# EAGLE design sunjar-v1.1 (EAGLE 6.4)
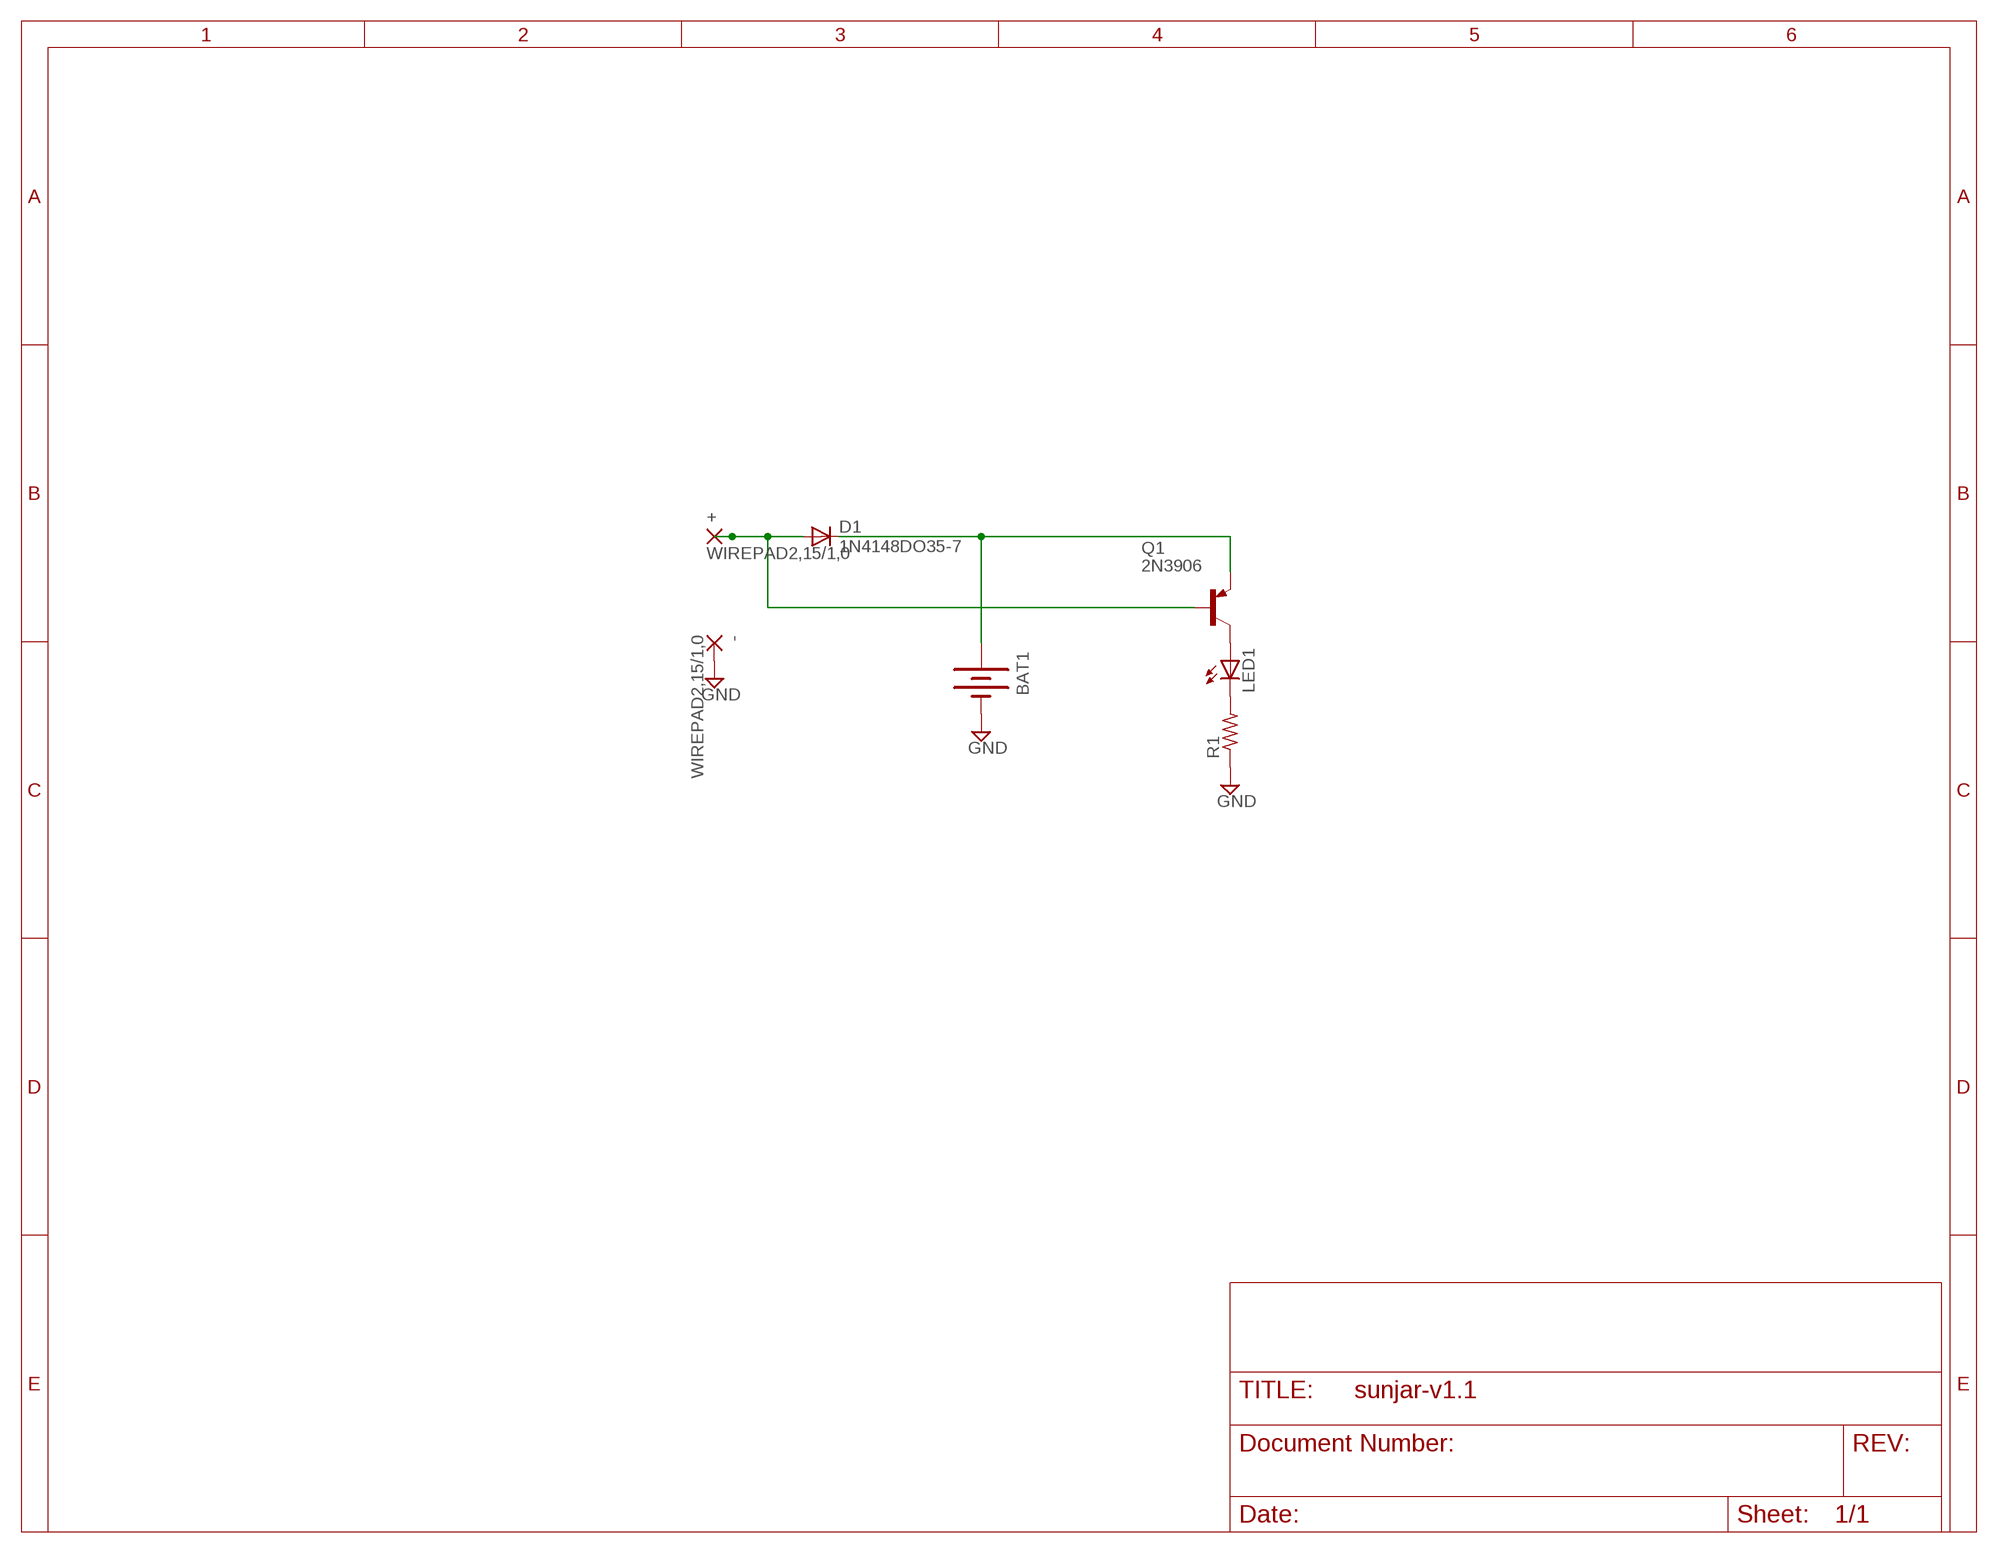
[diagram p0: schematic, sheet 1]

## Parts
+  WIREPAD2,15/1,0  [2,15/1,0]
-  WIREPAD2,15/1,0  [2,15/1,0]
BAT1  BATTERY245PTH  [BATTCON_245MM_PTH]
D1  1N4148DO35-7  [DO35-7]
LED1  LED5MM  [LED5MM]
Q1  2N3906  [TO92]
R1  R-US_0207/10  [0207/10]

## Nets
GND: -.1(P) BAT1.2(-) R1.1
N$1: LED1.K(C) R1.2
N$2: LED1.A Q1.1(C)
N$3: +.1(P) D1.A Q1.2(B)
N$4: BAT1.3(+) D1.C Q1.3(E)

## Library data of the parts
+ - = wirepad:WIREPAD: Wire PAD connect wire on PCB
BAT1 = SparkFun-Electromechanical:BATTERY: Battery Holders Various common sizes : AA, AAA, 20mm coin cell and 12mm coin cell. 20MM_4LEGS, BATT-10373
D1 = diode:1N4148: DIODE high speed (Philips)
LED1 = led:LED: LED OSRAM: - CHIPLED LG R971, LG N971, LY N971, LG Q971, LY Q971, LO R971, LY R971 LH N974, LH R974 LS Q976, LO Q976, LY Q976 LO Q996 - Hyper CHIPLED LW Q18S LB Q993, LB Q99A, LB R99A - SideLED LS A670, LO A670, LY A670, LG A670, LP A670 LB A673, LV A673, LT A673, LW A673 LH A674 LY A675 LS A676, LA A676, LO A676, LY A676, LW A676 LS A679, LY A679, LG A679 - Hyper Micro SIDELED® LS Y876, LA Y876, LO Y876, LY Y876 LT Y87S - SmartLED LW L88C, LW L88S LB L89C, LB L89S, LG L890 LS L89K, LO L89K, LY L89K LS L896, LA L896, LO L896, LY L896 - TOPLED LS T670, LO T670, LY T670, LG T670, LP T670 LSG T670, LSP T670, LSY T670, LOP T670, LYG T670 LG T671, LOG T671, LSG T671 LB T673, LV T673, LT T673, LW T673 LH T674 LS T676, LA T676, LO T676, LY T676, LB T676, LH T676, LSB T676, LW T676 LB T67C, LV T67C, LT T67C, LS T67K, LO T67K, LY T67K, LW E67C LS E67B, LA E67B, LO E67B, LY E67B, LB E67C, LV E67C, LT E67C LW T67C LS T679, LY T679, LG T679 LS T770, LO T770, LY T770, LG T770, LP T770 LB T773, LV T773, LT T773, LW T773 LH T774 LS E675, LA E675, LY E675, LS T675 LS T776, LA T776, LO T776, LY T776, LB T776 LHGB T686 LT T68C, LB T68C - Hyper Mini TOPLED® LB M676 - Mini TOPLED Santana® LG M470 LS M47K, LO M47K, LY M47K Source: http://www.osram.convergy.de LUXEON: - LUMILED® LXK2-PW12-R00, LXK2-PW12-S00, LXK2-PW14-U00, LXK2-PW14-V00 LXK2-PM12-R00, LXK2-PM12-S00, LXK2-PM14-U00 LXK2-PE12-Q00, LXK2-PE12-R00, LXK2-PE12-S00, LXK2-PE14-T00, LXK2-PE14-U00 LXK2-PB12-K00, LXK2-PB12-L00, LXK2-PB12-M00, LXK2-PB14-N00, LXK2-PB14-P00, LXK2-PB14-Q00 LXK2-PR12-L00, LXK2-PR12-M00, LXK2-PR14-Q00, LXK2-PR14-R00 LXK2-PD12-Q00, LXK2-PD12-R00, LXK2-PD12-S00 LXK2-PH12-R00, LXK2-PH12-S00 LXK2-PL12-P00, LXK2-PL12-Q00, LXK2-PL12-R00 Source: www.luxeon.com KINGBRIGHT: KA-3528ASYC Source: www.kingbright.com
Q1 = transistor-pnp:2N3906: PNP Transistor
R1 = rcl:R-US_: RESISTOR, American symbol

## Board
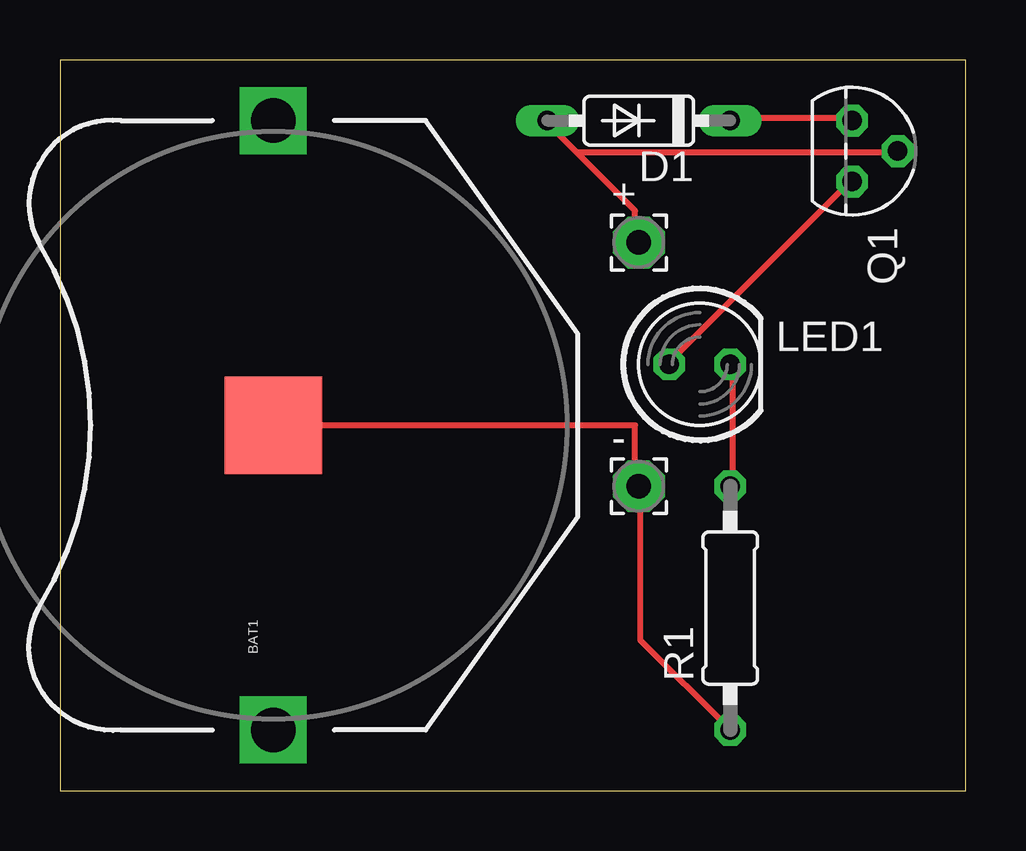
[diagram p1: board, top side]
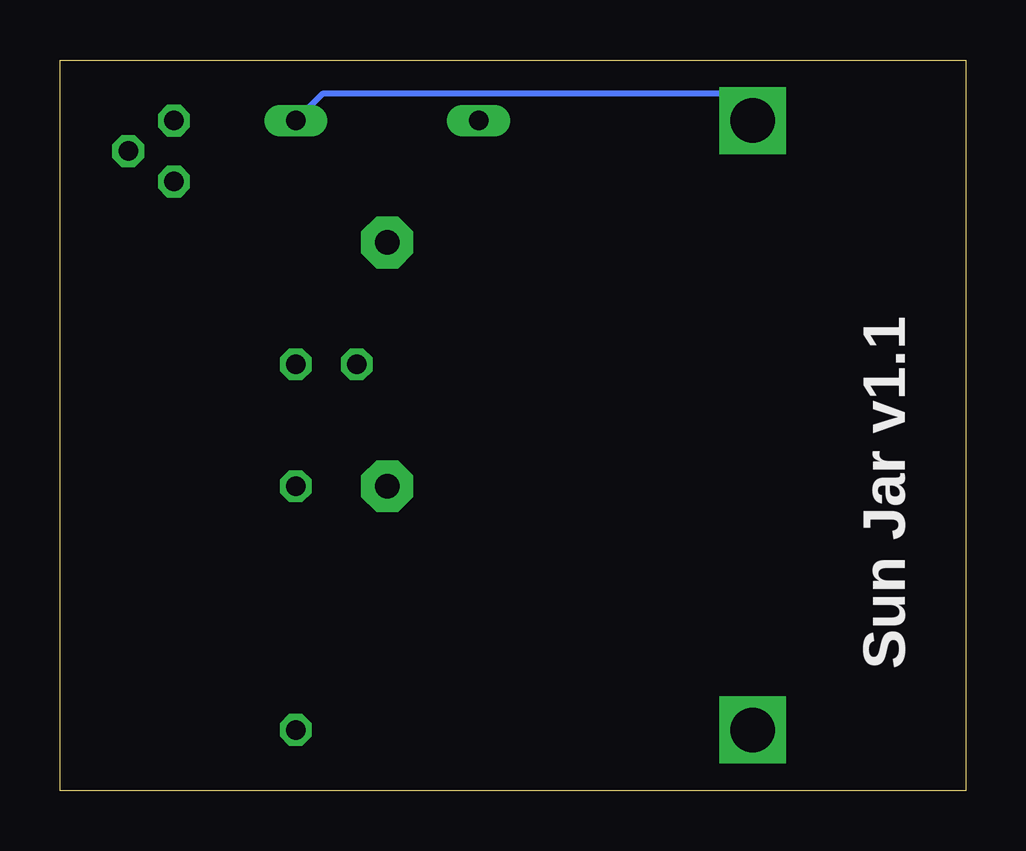
[diagram p2: board, bottom side, seen from below]

Size 37.77 x 30.47 mm. Coordinates in mm from the lower left corner, seen from the top.
Outline: 0,0 37.77,0 37.77,30.47 0,30.47 0,0
Copper layers (1*16): Top 0.035mm / dielectric 1.5mm / Bottom 0.035mm
Design rules "default": minimum track width 10mil, minimum drill 24mil, track to track 8mil, track to pad 8mil, pad to pad 8mil, via to via 8mil, smd to smd 8mil, copper to edge 40mil, drill to drill 8mil, minimum pad ring 10mil, minimum via ring 8mil, stop-mask expansion 4mil, vias tented up to drill 0mil, thermal gap 10mil

### Footprints (pad centres in the part's own frame; a part is rotated, then mirrored left to right if it is on the bottom)
2,15/1,0 = drill 1.016 pad 2.159 octagon: 1 0,0
BATTCON_245MM_PTH = drill 1.854 square: 1 -12.7,0; 3 12.7,0 | smd 4.064 x 4.064: 2 0,0
DO35-7 = drill 0.813 long: A 3.81,0; C -3.81,0
LED5MM = drill 0.813 octagon: A -1.27,0; K 1.27,0
TO92 = drill 0.813 octagon: 1 1.27,0; 2 0,1.905; 3 -1.27,0
0207/10 = drill 0.813 octagon: 1 -5.08,0; 2 5.08,0

### Placement (x,y rotation side)
+  24.13,22.86 0 top
-  24.13,12.7 0 top
BAT1  8.89,15.24 90 top
D1  24.13,27.94 180 top
LED1  26.67,17.78 0 top
Q1  33.02,26.67 270 top
R1  27.94,7.62 90 top

### Tracks (layer width: path | path; a pad name or v marks a point on that pad's centre or on a via)
GND
  Top 0.254: R1.1 24.18,6.3 24.18,12.6 -.1 23.98,12.8 23.98,15.24 BAT1.2
N$1
  Top 0.254: R1.2 28.04,12.8 28.04,17.68 LED1.K
N$2
  Top 0.254: LED1.A 25.4,17.88 32.92,25.4 Q1.1
N$3
  Top 0.254: 21.54,26.62 23.98,24.18 23.98,22.96 +.1 | 21.54,26.62 20.32,27.84 D1.A | 21.54,26.62 34.75,26.62 Q1.2
N$4
  Top 0.254: D1.C 28.04,28.04 32.92,28.04 Q1.3
  Bottom 0.254: D1.C 26.82,29.06 9.96,29.06 8.94,28.04 BAT1.3

### Text on the board
bPlace: Sun Jar v1.1